# EAGLE design zeta2rework_lw (EAGLE 9.0.1)
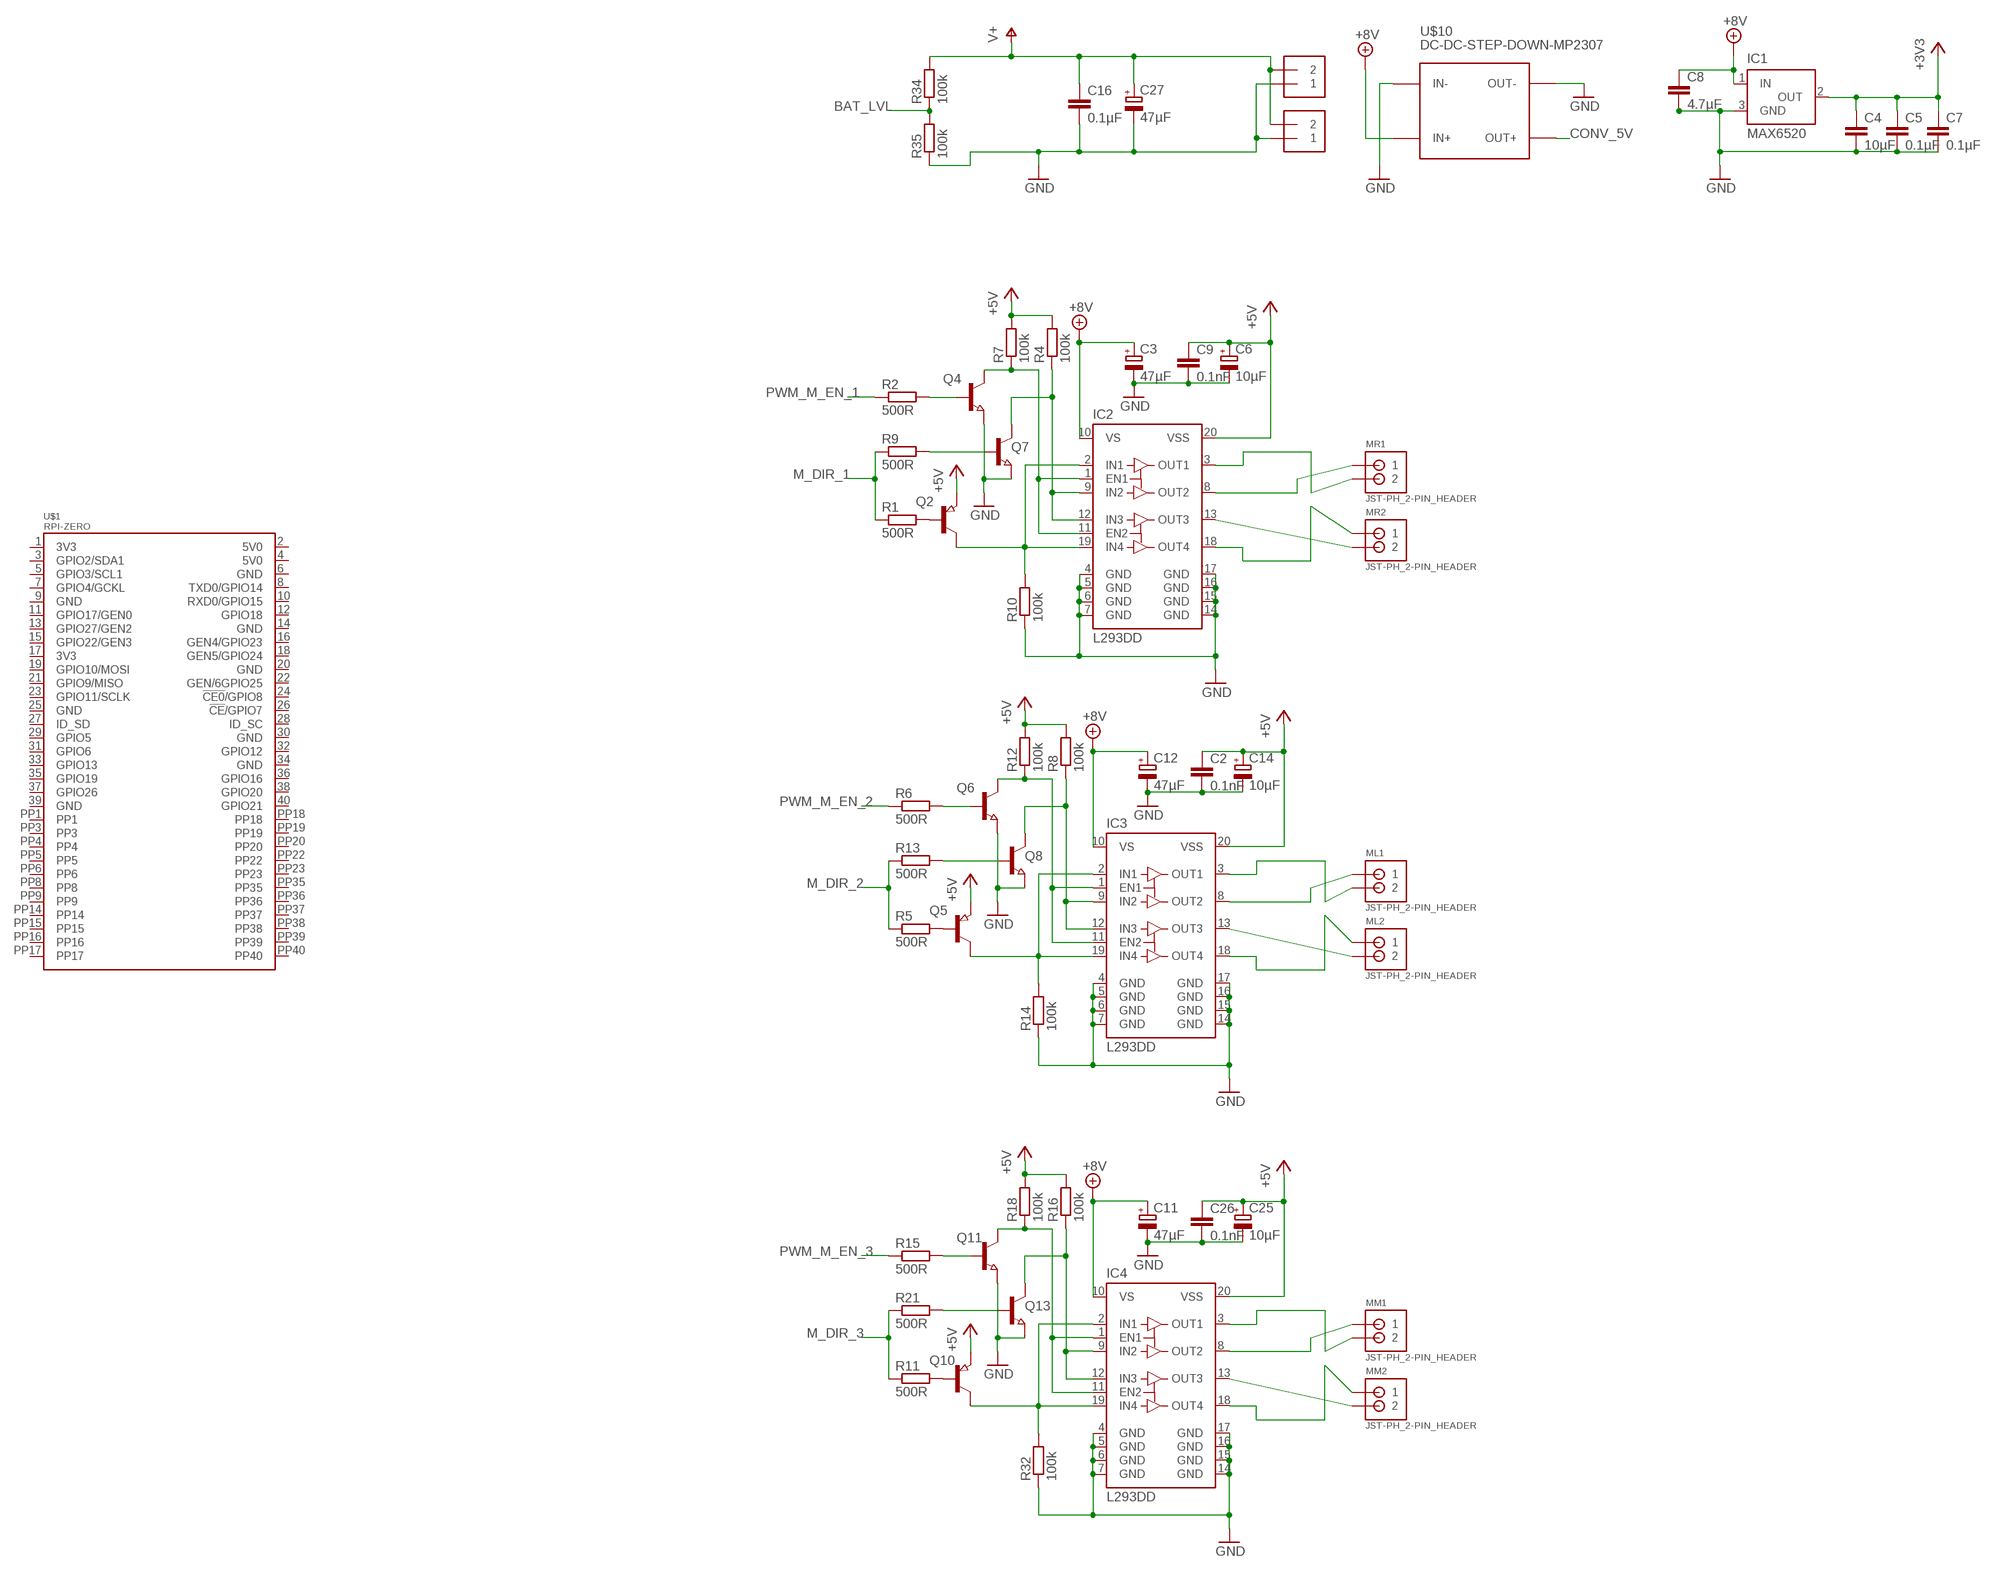
[diagram p0: schematic, sheet 1, part 1 of 2]
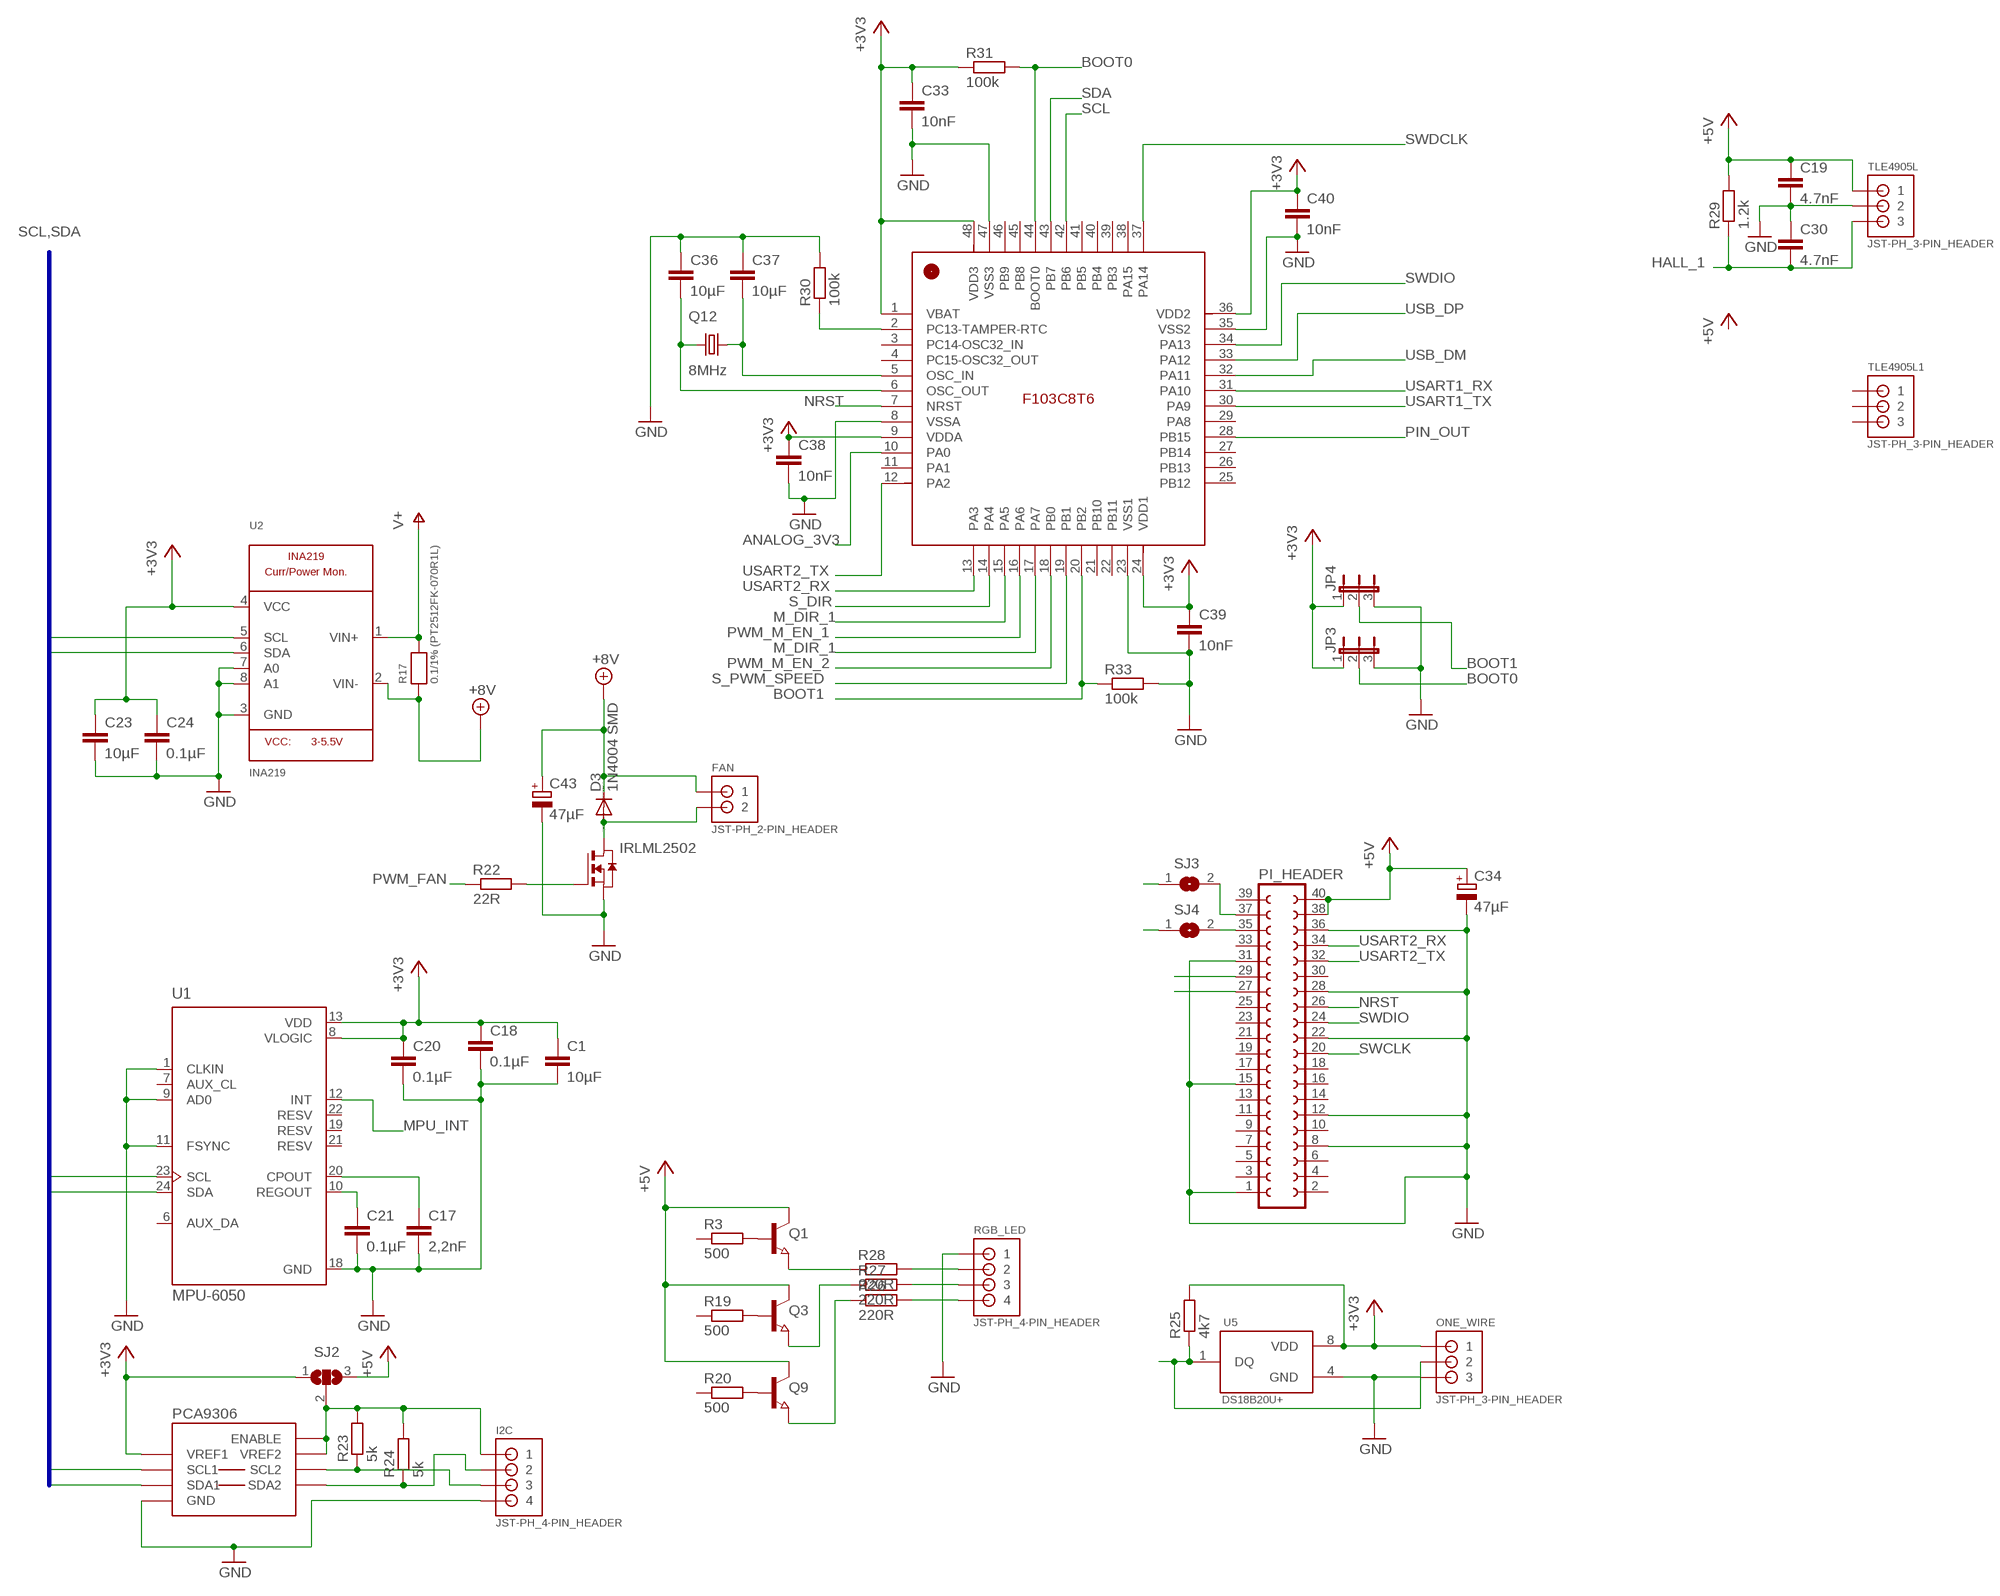
[diagram p1: schematic, sheet 1, part 2 of 2]

## Parts
C1  10µF  C-EUC1206  [C1206]
C2  0.1nF  C-EUC1206  [C1206]
C3  47µF  CPOL-EUUD-4X5,8  [UD-4X5,8_NICHICON]
C4  10µF  C-EUC1206  [C1206]
C5  0.1µF  C-EUC1206  [C1206]
C6  10µF  CPOL-EUUD-4X5,8  [UD-4X5,8_NICHICON]
C7  0.1µF  C-EUC1206  [C1206]
C8  4.7µF  C-EUC1206  [C1206]
C9  0.1nF  C-EUC1206  [C1206]
C11  47µF  CPOL-EUUD-4X5,8  [UD-4X5,8_NICHICON]
C12  47µF  CPOL-EUUD-4X5,8  [UD-4X5,8_NICHICON]
C14  10µF  CPOL-EUUD-4X5,8  [UD-4X5,8_NICHICON]
C16  0.1µF  C-EUC1206  [C1206]
C17  2,2nF  C-EUC1206  [C1206]
C18  0.1µF  C-EUC1206  [C1206]
C19  4.7nF  C-EUC1206  [C1206]
C20  0.1µF  C-EUC1206  [C1206]
C21  0.1µF  C-EUC1206  [C1206]
C23  10µF  C-EUC1206  [C1206]
C24  0.1µF  C-EUC1206  [C1206]
C25  10µF  CPOL-EUUD-4X5,8  [UD-4X5,8_NICHICON]
C26  0.1nF  C-EUC1206  [C1206]
C27  47µF  CPOL-EUUD-4X5,8  [UD-4X5,8_NICHICON]
C30  4.7nF  C-EUC1206  [C1206]
C33  10nF  C-EUC1206  [C1206]
C34  47µF  CPOL-EUUD-4X5,8  [UD-4X5,8_NICHICON]
C36  10µF  C-EUC1206  [C1206]
C37  10µF  C-EUC1206  [C1206]
C38  10nF  C-EUC1206  [C1206]
C39  10nF  C-EUC1206  [C1206]
C40  10nF  C-EUC1206  [C1206]
C43  47µF  CPOL-EUUD-4X5,8  [UD-4X5,8_NICHICON]
D3  1N4004 SMD  DIODE-MELF-MLL41  [MELF-MLL41]
FAN  JST-PH_2-PIN_HEADER  [JST_B2B-PH_HEADER]
I2C  JST-PH_4-PIN_HEADER  [JST_B4B-PH_HEADER]
IC1  MAX6520  [SOT23]
IC2  L293DD  [SO20]
IC3  L293DD  [SO20]
IC4  L293DD  [SO20]
IRLML2502  NMOSSOT23  [SOT-23]
JP3  JP2E  [JP2]
JP4  JP2E  [JP2]
ML1  JST-PH_2-PIN_HEADER  [JST_B2B-PH_HEADER]
ML2  JST-PH_2-PIN_HEADER  [JST_B2B-PH_HEADER]
MM1  JST-PH_2-PIN_HEADER  [JST_B2B-PH_HEADER]
MM2  JST-PH_2-PIN_HEADER  [JST_B2B-PH_HEADER]
MR1  JST-PH_2-PIN_HEADER  [JST_B2B-PH_HEADER]
MR2  JST-PH_2-PIN_HEADER  [JST_B2B-PH_HEADER]
ONE_WIRE  JST-PH_3-PIN_HEADER  [JST_B3B-PH_HEADER]
PCA9306  IC2_LEVEL_TRANSLATER  [SOIC-8]
PI_HEADER  FE20-2  [FE20-2]
Q1  NPN-TRANSISTOR_SOT23  [SOT23]
Q2  PNP-TRANSISTOR_SOT23  [SOT23]
Q3  NPN-TRANSISTOR_SOT23  [SOT23]
Q4  NPN-TRANSISTOR_SOT23  [SOT23]
Q5  PNP-TRANSISTOR_SOT23  [SOT23]
Q6  NPN-TRANSISTOR_SOT23  [SOT23]
Q7  NPN-TRANSISTOR_SOT23  [SOT23]
Q8  NPN-TRANSISTOR_SOT23  [SOT23]
Q9  NPN-TRANSISTOR_SOT23  [SOT23]
Q10  PNP-TRANSISTOR_SOT23  [SOT23]
Q11  NPN-TRANSISTOR_SOT23  [SOT23]
Q12  8MHz  KX-13  [7.0X5.0]
Q13  NPN-TRANSISTOR_SOT23  [SOT23]
R1  500R  R-EU_R0603  [R0603]
R2  500R  R-EU_R0603  [R0603]
R3  500  R-EU_R0603  [R0603]
R4  100k  R-EU_R0603  [R0603]
R5  500R  R-EU_R0603  [R0603]
R6  500R  R-EU_R0603  [R0603]
R7  100k  R-EU_R0603  [R0603]
R8  100k  R-EU_R0603  [R0603]
R9  500R  R-EU_R0603  [R0603]
R10  100k  R-EU_R0603  [R0603]
R11  500R  R-EU_R0603  [R0603]
R12  100k  R-EU_R0603  [R0603]
R13  500R  R-EU_R0603  [R0603]
R14  100k  R-EU_R0603  [R0603]
R15  500R  R-EU_R0603  [R0603]
R16  100k  R-EU_R0603  [R0603]
R17  0.1/1% (PT2512FK-070R1L)  RESISTOR2512  [2512]
R18  100k  R-EU_R0603  [R0603]
R19  500  R-EU_R0603  [R0603]
R20  500  R-EU_R0603  [R0603]
R21  500R  R-EU_R0603  [R0603]
R22  22R  R-EU_R0603  [R0603]
R23  5k  R-EU_R0603  [R0603]
R24  5k  R-EU_R0603  [R0603]
R25  4k7  R-EU_R0603  [R0603]
R26  220R  R-EU_R0603  [R0603]
R27  220R  R-EU_R0603  [R0603]
R28  220R  R-EU_R0603  [R0603]
R29  1.2k  R-EU_R0603  [R0603]
R30  100k  R-EU_R0603  [R0603]
R31  100k  R-EU_R0603  [R0603]
R32  100k  R-EU_R0603  [R0603]
R33  100k  R-EU_R0603  [R0603]
R34  100k  R-EU_R0603  [R0603]
R35  100k  R-EU_R0603  [R0603]
RGB_LED  JST-PH_4-PIN_HEADER  [JST_B4B-PH_HEADER]
SJ2  SJ2W  [SJ_2]
SJ3  SOLDERJUMPERREFLOW_NOPASTE  [SOLDERJUMPER_REFLOW_NOPASTE]
SJ4  SOLDERJUMPERREFLOW_NOPASTE  [SOLDERJUMPER_REFLOW_NOPASTE]
SUPPLY_IN  TERMBLOCK_1X2-3.5MM  [1X2-3.5MM]
SUPPLY_IN1  TERMBLOCK_1X2-3.5MM  [1X2-3.5MM]
TLE4905L  JST-PH_3-PIN_HEADER  [JST_B3B-PH_HEADER]
TLE4905L1  JST-PH_3-PIN_HEADER  [JST_B3B-PH_HEADER]
U1  MPU-6050  [QFN50P400X400X95-24N]
U2  INA219  [SOT23-8]
U5  DS18B20U+  [SOP65P490X95-8N]
U$1  RPI-ZERO  [RASP_PI_ZERO_BOARD_FULL]
U$4  STM32F103C8T6  [LQFP48_7X7MM_0.5MMPP]
U$10  DC-DC-STEP-DOWN-MP2307  [DC-DC-STEP-DOWN-MP2307]

## Nets
+3V3: C1.1 C4.1 C5.1 C7.1 C18.1 C20.1 C23.1 C24.1 C33.1 C38.1 C39.1 C40.1 IC1.2(OUT) JP3.1 JP4.1 ONE_WIRE.P1 PCA9306.1(VREF1) R25.2 R31.1 SJ2.1 U1.8(VLOGIC) U1.13(VDD) U2.4(VCC) U5.8(VDD) U$4.1(VBAT) U$4.9(VDDA) U$4.24(VDD1) U$4.36(VDD2) U$4.48(VDD3)
+5V: C2.1 C6.+ C9.1 C14.+ C19.1 C25.+ C26.1 C34.+ IC2.20(VSS) IC3.20(VSS) IC4.20(VSS) PI_HEADER.38 PI_HEADER.40 Q1.3(C) Q2.2(E) Q3.3(C) Q5.2(E) Q9.3(C) Q10.2(E) R4.2 R7.2 R8.2 R12.2 R16.2 R18.2 R29.2 SJ2.3 TLE4905L.P1
+8V: C3.+ C8.1 C11.+ C12.+ C43.+ D3.C FAN.P1 IC1.1(IN) IC2.10(VS) IC3.10(VS) IC4.10(VS) R17.1 U2.2(VIN-) U$10.IN+
ANALOG_3V3: U$4.10(PA0)
BAT_LVL: R34.1 R35.2
BOOT0: JP3.2 R31.2 U$4.44(BOOT0)
BOOT1: JP4.2 R33.1 U$4.20(PB2)
BOOT2: PI_HEADER.29
BOOT3: PI_HEADER.27
CONV_5V: U$10.OUT+
GND: C1.2 C2.2 C3.- C4.2 C5.2 C6.- C7.2 C8.2 C9.2 C11.- C12.- C14.- C16.2 C17.2 C18.2 C19.2 C20.2 C21.2 C23.2 C24.2 C25.- C26.2 C27.- C30.1 C33.2 C34.- C36.1 C37.1 C38.2 C39.2 C40.2 C43.- I2C.P4 IC1.3(GND) IC2.4(GND) IC2.5(GND) IC2.6(GND) IC2.7(GND) IC2.14(GND) IC2.15(GND) IC2.16(GND) IC2.17(GND) IC3.4(GND) IC3.5(GND) IC3.6(GND) IC3.7(GND) IC3.14(GND) IC3.15(GND) IC3.16(GND) IC3.17(GND) IC4.4(GND) IC4.5(GND) IC4.6(GND) IC4.7(GND) IC4.14(GND) IC4.15(GND) IC4.16(GND) IC4.17(GND) IRLML2502.2(S) JP3.3 JP4.3 ONE_WIRE.P3 PCA9306.4(GND) PI_HEADER.1 PI_HEADER.8 PI_HEADER.12 PI_HEADER.15 PI_HEADER.22 PI_HEADER.28 PI_HEADER.31 PI_HEADER.36 Q4.2(E) Q6.2(E) Q7.2(E) Q8.2(E) Q11.2(E) Q13.2(E) R10.1 R14.1 R30.2 R32.1 R33.2 R35.1 RGB_LED.P1 SUPPLY_IN1.1 SUPPLY_IN.1 TLE4905L.P2 U1.1(CLKIN) U1.9(AD0) U1.11(FSYNC) U1.18(GND) U2.3(GND) U2.7(A0) U2.8(A1) U5.4(GND) U$4.8(VSSA) U$4.23(VSS1) U$4.35(VSS2) U$4.47(VSS3) U$10.IN- U$10.OUT-
HALL_1: C30.2 R29.1 TLE4905L.P3
M_DIR_1: R1.1 R9.1 U$4.15(PA5) U$4.17(PA7)
M_DIR_2: R5.1 R13.1
M_DIR_3: R11.1 R21.1
MPU_INT: U1.12(INT)
N$1: IC2.9(IN2) IC2.12(IN3) Q7.3(C) R4.1
N$2: IC3.18(OUT4) ML2.P1
N$3: IC3.13(OUT3) ML2.P2
N$4: R26.2 RGB_LED.P4
N$5: IC2.2(IN1) IC2.19(IN4) Q2.3(C) R10.2
N$6: IC3.9(IN2) IC3.12(IN3) Q8.3(C) R8.1
N$7: IC3.2(IN1) IC3.19(IN4) Q5.3(C) R14.2
N$8: IC2.1(EN1) IC2.11(EN2) Q4.3(C) R7.1
N$9: IC3.1(EN1) IC3.11(EN2) Q6.3(C) R12.1
N$10: Q2.1(B) R1.2
N$11: Q4.1(B) R2.2
N$12: Q7.1(B) R9.2
N$13: Q5.1(B) R5.2
N$14: Q6.1(B) R6.2
N$15: Q8.1(B) R13.2
N$16: R27.2 RGB_LED.P3
N$17: IC2.8(OUT2) MR1.P1
N$18: IC2.3(OUT1) MR1.P2
N$19: R28.2 RGB_LED.P2
N$20: IC2.18(OUT4) MR2.P1
N$21: IC2.13(OUT3) MR2.P2
N$22: Q1.1(B) R3.2
N$23: Q3.1(B) R19.2
N$24: Q1.2(E) R28.1
N$25: IC3.8(OUT2) ML1.P1
N$26: IC3.3(OUT1) ML1.P2
N$27: IC4.9(IN2) IC4.12(IN3) Q13.3(C) R16.1
N$28: Q3.2(E) R27.1
N$29: Q9.2(E) R26.1
N$30: IC4.2(IN1) IC4.19(IN4) Q10.3(C) R32.2
N$31: IC4.1(EN1) IC4.11(EN2) Q11.3(C) R18.1
N$32: Q9.1(B) R20.2
N$33: Q10.1(B) R11.2
N$34: C17.1 U1.20(CPOUT)
N$35: Q11.1(B) R15.2
N$36: C21.1 U1.10(REGOUT)
N$37: IRLML2502.3(G) R22.2
N$41: I2C.P1 PCA9306.7(VREF2) PCA9306.8(ENABLE) R23.2 R24.2 SJ2.2
N$42: I2C.P3 PCA9306.6(SCL2) R23.1
N$43: I2C.P2 PCA9306.5(SDA2) R24.1
N$44: PI_HEADER.37 SJ3.2
N$45: PI_HEADER.35 SJ4.2
N$46: C36.2 Q12.1 U$4.6(OSC_OUT)
N$47: C37.2 Q12.3 U$4.5(OSC_IN)
N$48: Q13.1(B) R21.2
N$49: R30.1 U$4.2(PC13-TAMPER-RTC)
N$50: IC4.8(OUT2) MM1.P1
N$51: IC4.3(OUT1) MM1.P2
N$52: IC4.18(OUT4) MM2.P1
N$53: IC4.13(OUT3) MM2.P2
N$55: D3.A FAN.P2 IRLML2502.1(D)
NRST: PI_HEADER.26 U$4.7(NRST)
PIN_OUT: U$4.28(PB15)
PWM_FAN: R22.1
PWM_M_EN_1: R2.1 U$4.16(PA6)
PWM_M_EN_2: R6.1 U$4.18(PB0)
PWM_M_EN_3: R15.1
S_DIR: U$4.14(PA4)
S_PWM_SPEED: U$4.19(PB1)
SCL: U1.23(SCL) U2.5(SCL) U$4.42(PB6)
SCL2: PCA9306.2(SCL1)
SCL3: SJ4.1
SDA: U1.24(SDA) U2.6(SDA) U$4.43(PB7)
SDA2: PCA9306.3(SDA1)
SDA3: SJ3.1
SWCLK: PI_HEADER.20
SWDCLK: U$4.37(PA14)
SWDIO: PI_HEADER.24 U$4.34(PA13)
TEMPERATURE: ONE_WIRE.P2 R25.1 U5.1(DQ)
USART1_RX: U$4.31(PA10)
USART1_TX: U$4.30(PA9)
USART2_RX: PI_HEADER.34 U$4.13(PA3)
USART2_TX: PI_HEADER.32 U$4.12(PA2)
USB_DM: U$4.32(PA11)
USB_DP: U$4.33(PA12)
V+: C16.1 C27.+ R17.2 R34.2 SUPPLY_IN1.2 SUPPLY_IN.2 U2.1(VIN+)
Unconnected: PI_HEADER.2 PI_HEADER.3 PI_HEADER.4 PI_HEADER.5 PI_HEADER.6 PI_HEADER.7 PI_HEADER.9 PI_HEADER.10 PI_HEADER.11 PI_HEADER.13 PI_HEADER.14 PI_HEADER.16 PI_HEADER.17 PI_HEADER.18 PI_HEADER.19 PI_HEADER.21 PI_HEADER.23 PI_HEADER.25 PI_HEADER.30 PI_HEADER.33 PI_HEADER.39 R3.1 R19.1 R20.1 TLE4905L1.P1 TLE4905L1.P2 TLE4905L1.P3 U1.6(AUX_DA) U1.7(AUX_CL) U1.19(RESV) U1.21(RESV) U1.22(RESV) U$1.1(3V3) U$1.2(5V0) U$1.3(GPIO2/SDA1) U$1.4(5V0) U$1.5(GPIO3/SCL1) U$1.6(GND) U$1.7(GPIO4/GCKL) U$1.8(TXD0/GPIO14) U$1.9(GND) U$1.10(RXD0/GPIO15) U$1.11(GPIO17/GEN0) U$1.12(GPIO18) U$1.13(GPIO27/GEN2) U$1.14(GND) U$1.15(GPIO22/GEN3) U$1.16(GEN4/GPIO23) U$1.17(3V3) U$1.18(GEN5/GPIO24) U$1.19(GPIO10/MOSI) U$1.20(GND) U$1.21(GPIO9/MISO) U$1.22(GEN/6GPIO25) U$1.23(GPIO11/SCLK) U$1.24(!CE0!/GPIO8) U$1.25(GND) U$1.26(!CE!/GPIO7) U$1.27(ID_SD) U$1.28(ID_SC) U$1.29(GPIO5) U$1.30(GND) U$1.31(GPIO6) U$1.32(GPIO12) U$1.33(GPIO13) U$1.34(GND) U$1.35(GPIO19) U$1.36(GPIO16) U$1.37(GPIO26) U$1.38(GPIO20) U$1.39(GND) U$1.40(GPIO21) U$1.PP1 U$1.PP3 U$1.PP4 U$1.PP5 U$1.PP6 U$1.PP8 U$1.PP9 U$1.PP14 U$1.PP15 U$1.PP16 U$1.PP17 U$1.PP18 U$1.PP19 U$1.PP20 U$1.PP22 U$1.PP23 U$1.PP35 U$1.PP36 U$1.PP37 U$1.PP38 U$1.PP39 U$1.PP40 U$4.3(PC14-OSC32_IN) U$4.4(PC15-OSC32_OUT) U$4.11(PA1) U$4.21(PB10) U$4.22(PB11) U$4.25(PB12) U$4.26(PB13) U$4.27(PB14) U$4.29(PA8) U$4.38(PA15) U$4.39(PB3) U$4.40(PB4) U$4.41(PB5) U$4.45(PB8) U$4.46(PB9)

## Buses
SCL,SDA

## Library data of the parts
C1 C2 C4 C5 C7-C9 C16-C21 C23 C24 C26 C30 C33 C36-C40 = rcl:C-EU: CAPACITOR, European symbol; SPICEPREFIX: C
C3 C6 C11 C12 C14 C25 C27 C34 C43 = rcl:CPOL-EU: POLARIZED CAPACITOR, European symbol; SPICEPREFIX: C
D3 = diode:DIODE-: DIODE
FAN ML1 ML2 MM1 MM2 MR1 MR2 = srg:JST-PH_2-PIN_HEADER: 2-pin JST PH Shrouded Header, top entry P/N B2B-PH-K-S Mating connector PHR-2 Mating cable assembly: Sparkfun PRT-09914
I2C RGB_LED = srg:JST-PH_4-PIN_HEADER: 4-pin JST PH Shrouded Header, top entry P/N B4B-PH-K-S Mating connector PHR-4 Mating cable assembly: Sparkfun PRT-09916
IC1 = maxim:MAX6520: 1.2V Voltage Reference 50ppm/°C, SOT23, 3-Terminal Source: Data sheet; MF: MAXIM; MPN: MAX6520EUR-T; OC_FARNELL: unknown; OC_NEWARK: 02J4586
IC2-IC4 = st-microelectronics:L293DD: PUSH-PULL FOUR CHANNEL DRIVER WITH DIODES Source: http://www.st.com/stonline/books/pdf/docs/1330.pdf; OC_FARNELL: unknown
IRLML2502 = zetex:NMOSSOT23: MOS FET; OC_FARNELL: unknown; OC_NEWARK: unknown
JP3 JP4 = jumper:JP2E: JUMPER
ONE_WIRE TLE4905L TLE4905L1 = srg:JST-PH_3-PIN_HEADER: 3-pin JST PH Shrouded Header, top entry P/N B3B-PH-K-S Mating connector PHR-3
PCA9306 = srg:IC2_LEVEL_TRANSLATER: I2C Level Translator PCA9306 Data Sheet Sparkfun breakout board schematic
PI_HEADER = con-lsta:FE20-2: FEMALE HEADER; OC_FARNELL: unknown; OC_NEWARK: unknown
Q1 Q3 Q4 Q6-Q9 Q11 Q13 = semicon-smd-ipc:NPN-TRANSISTOR_: NPN TRANSISTOR
Q2 Q5 Q10 = semicon-smd-ipc:PNP-TRANSISTOR_: PNP TRANSISTOR
Q12 = crystal-geyer_V1_0:KX: Quartz Crystals (MHz) SMD: KX - Serie Model Size l/w/h [mm] Frequency Range Frequency Stability Temp. Range [°C] Load Capacitance AECQ 200 availabel Datasheet KX-4 KX-5 KX-6 KX-7 KX-9A KX-9B KX-12A KX-12B KX-13 KX-20 KX-K KX-KS 1.6/1.2/0.3 2.0/1.6/0.45 2.5/2.0/0.55 3.2/2.5/0.8 5.0/3.2/1.0 5.0/3.2/1.1 6.0/3.5/1.1 6.0/3.5/1.0 7.0/5.0 /1.3 11.6/5.5/1.6 12.3/4.5/4.2 12.3/4.5/3.2 24.0 ~ 80.0 MHz 16.0 ~ 80.0 MHz 12.0 ~ 80.0 MHz 8.0 ~ 60.0 MHz 7,68 ~ 300,0 MHz 8,0 ~ 50,0 MHz 8,0 ~ 150,0 MHz 8,0 ~ 50,0 MHz 6,0 ~ 160,0 MHz 3,579 ~ 25,0 MHz 3,579 ~ 70,0 MHz 3,579 ~ 70,0 MHz ±10 … ±50ppm ±10 … ±50ppm ±10 … ±50ppm ±10 … ±50ppm ±10 … ±50ppm ±10 … ±50ppm ±10 … ±50ppm ±10 … ±50ppm ±10 … ±50ppm ±50ppm ±10 … ±50ppm ±10 … ±50ppm (*) -40°C …+85°C (*) -40°C …+125°C (*) -40°C …+125°C (*) -40°C …+125°C (*) -40°C …+105°C (*) -40°C …+105°C (*) -40°C …+125°C (*) -40°C …+105°C (*) -40°C …+105°C (*) -40°C …+105°C (*) -40°C …+85°C (*) -40°C …+85°C 8, 8…16 8, 8…16 10, 8…16 12, 7…20 16, 10…20 16, 10…20 16, 10…20 16, 12…20 16, 12…20 16, 12…20 16, 12…30 16, 12…30 - yes yes yes - - - - - - - - KX-4.pdf KX-5.pdf KX-6.pdf KX-7.pdf KX-9A.pdf KX-9B.pdf KX-12A.pdf KX-12B.pdf KX-13.pdf KX-20.pdf KX-K.pdf KX-KS.pdf Details see: http://www.geyer-electronic.de/Frequenz-Produkte.9.0.html Created 2016-06-07, Hans Locher 2016 (C) Geyer Quartz Technology KX4,KX5,KX6,KX7,KX9A,KX9B,KX12A,KX12B,KX13,KX20,KXK,KXKS;1612;2016;2520;3225;5032;6035;7050;11655;12345;1,6x1,2;2,0x1,6;2,5x2,0;3,2x2,5;5,0x3,2;6,0x3,5;7,0x5,0;11,6x5,5;12,3x4,5;12,3x4,5;1.6x1.2;2.0x1.6;2.5x2.0;3.2x2.5;5.0x3.2;6.0x3.5;7.0x5.0;11.6x5.5;12.3x4.5;12.3x4.5;
R1-R16 R18-R35 = rcl:R-EU_: RESISTOR, European symbol; SPICEPREFIX: R
R17 = microbuilder:RESISTOR: Resistors 0402 - 0402 Surface Mount Package 22 Ohm 1% 1/16W [Digikey: 311-22.0LRTR-ND] 33 Ohm 5% 1/16W 1.0K 5% 1/16W 1.5K 5% 1/16W 2.0K 1% 1/16W 10.0K 1% 1/16W [Digikey: 311-10.0KLRTR-ND] 10.0K 5% 1/16W [Digikey: RMCF0402JT10K0TR-ND] 12.1K 1% 1/16W [Digikey: 311-22.0LRTR-ND] 100.0K 5% 1/16W 0603 - 0603 Surface Mount Package 0 Ohm 1/10 Watt 1% Resistor 15 Ohm 1/10 Watt 1% Resistor 33 Ohm 1/10 Watt 1% Resistor 49.9 Ohm 1/10 Watt 1% Resistor 100 Ohm 1/10 Watt 1% Resistor 150 Ohm 1/10 Watt 1% Resistor 240 Ohm 1/10 Watt 1% Resistor 390 Ohm 1/10 Watt 1% Resistor 560 Ohm 1/10 Watt 1% Resistor 680 Ohm 1/10 Watt 1% Resistor 750 Ohm 1/10 Watt 1% Resistor 1.0K Ohm 1/10 Watt 1% Resistor 1.5K Ohm 1/10 Watt 1% Resistor 2.0K Ohm 1/10 Watt 1% Resistor 2.2K Ohm 1/10 Watt 1% Resistor 3.3K Ohm 1/10 Watt 1% Resistor 4.7K Ohm 1/10 Watt 1% Resistor 10.0K Ohm 1/10 Watt 1% Resistor 12.0K Ohm 1/10 Watt 1% Resistor 12.1K Ohm 1/10 Watt 1% Resistor 20.0K Ohm 1/10 Watt 1% Resistor 33.0K Ohm 1/10 Watt 1% Resistor 100.0K Ohm 1/10 Watt 1% Resistor 0805 - 0805 Surface Mount Package 0 Ohm 1/8 Watt 1% Resistor 33 Ohm 1/8 Watt 1% Resistor 100 Ohm 1/8 Watt 1% Resistor 150 Ohm 1/8 Watt 1% Resistor 200 Ohm 1/8 Watt 1% Resistor 240 Ohm 1/8 Watt 1% Resistor 330 Ohm 1/8 Watt 1% Resistor 390 Ohm 1/8 Watt 1% Resistor 470 Ohm 1/8 Watt 1% Resistor 1.0K Ohm 1/8 Watt 1% Resistor 1.5K Ohm 1/8 Watt 1% Resistor 2.0K Ohm 1/8 Watt 1% Resistor 4.7K Ohm 1/8 Watt 1% Resistor 5.1K Ohm 1/8 Watt 1% Resistor 5.6K Ohm 1/8 Watt 1% Resistor 10.0K Ohm 1/8 Watt 1% Resistor 22.0K Ohm 1/8 Watt 1% Resistor 33.0K Ohm 1/8 Watt 1% Resistor 100K Ohm 1/8 Watt 1% Resistor 1206 - 1206 Surface Mount Package 2012 - 2010 Surface Mount Package 0.11 Ohm 1/2 Watt 1% Resistor - Digikey: RHM.11UCT-ND
SJ2 = jumper:SJ2W: SMD solder JUMPER
SJ3 SJ4 = microbuilder:SOLDERJUMPER: SMD Solder JUMPER Solder the two pads together to create a connection, or remove the solder to break it. REFLOW - Use this footprint for solder paste and reflow ovens. WAVE - Use this footprint for hand-soldering (larger pads). CLOSED - Has a trace between the two pads to ensure it is closed by default. The trace needs to be cut to disable the jumper, and can be closed again by creating a solder bridge between the two pads.
SUPPLY_IN SUPPLY_IN1 = microbuilder:TERMBLOCK_1X2: 3.5mm Terminal block http://www.ladyada.net/library/pcb/eaglelibrary.html
U1 = MPU-6050:MPU-6050: MPU-6050 Six-Axis (Gyro + Accelerometer) MEMS MotionTracking™ Devices; AVAILABILITY: Good; DESCRIPTION: 3-axis gyroscope, 3-axis accelerometer in a 4x4x0.9 housing; MF: TDK; MP: MPU-6050; PACKAGE: QFN-24 InvenSense; PRICE: 5.12 USD
U2 = INA219:INA219: INA219 - I2C Current/Power Monitor Voltage Range: 0-26V Accuracy: 0.5% Temperature: -40°C - 125°C; AVAILABILITY: Unavailable; DESCRIPTION: the ina219 is a high-side current shunt and power monitor with an i2c interface. the ina219 monitors both shunt drop ...; MF: Texas Instruments; MP: INA219; PACKAGE: None; PRICE: None
U5 = DS18B20U_:DS18B20U+: Board Mount Temperature Sensors Prgmble Resolution 1-Wire Parasite Pwr; AVAILABILITY: Unavailable; DESCRIPTION: Date Code: 1043+; RoHS Compliant: Yes;; MF: Maxim; MP: DS18B20U+; PACKAGE: TSSOP-8 Chip Coolers; PRICE: None
U$1 = rpi-zero:RPI-ZERO
U$4 = STM32F103C8T6:STM32F103C8T6; AVAILABILITY: Good; DESCRIPTION: Mainstream Performance line, ARM Cortex-M3 MCU with 64 Kbytes Flash, 72 MHz CPU, motor control, USB and CAN; MF: STMicroelectronics; MP: STM32F103C8T6; PACKAGE: LQFP-48 STMicroelectronics; PRICE: 3.83 USD
U$10 = diy-modules:DC-DC-STEP-DOWN-MP2307: DC/DC Step-Down Regulator based on MP2307DN chip MP2307 datasheet available here: https://cdn-shop.adafruit.com/datasheets/MP2307_r1.9.pdf Click here to find device on ebay.com

## Board
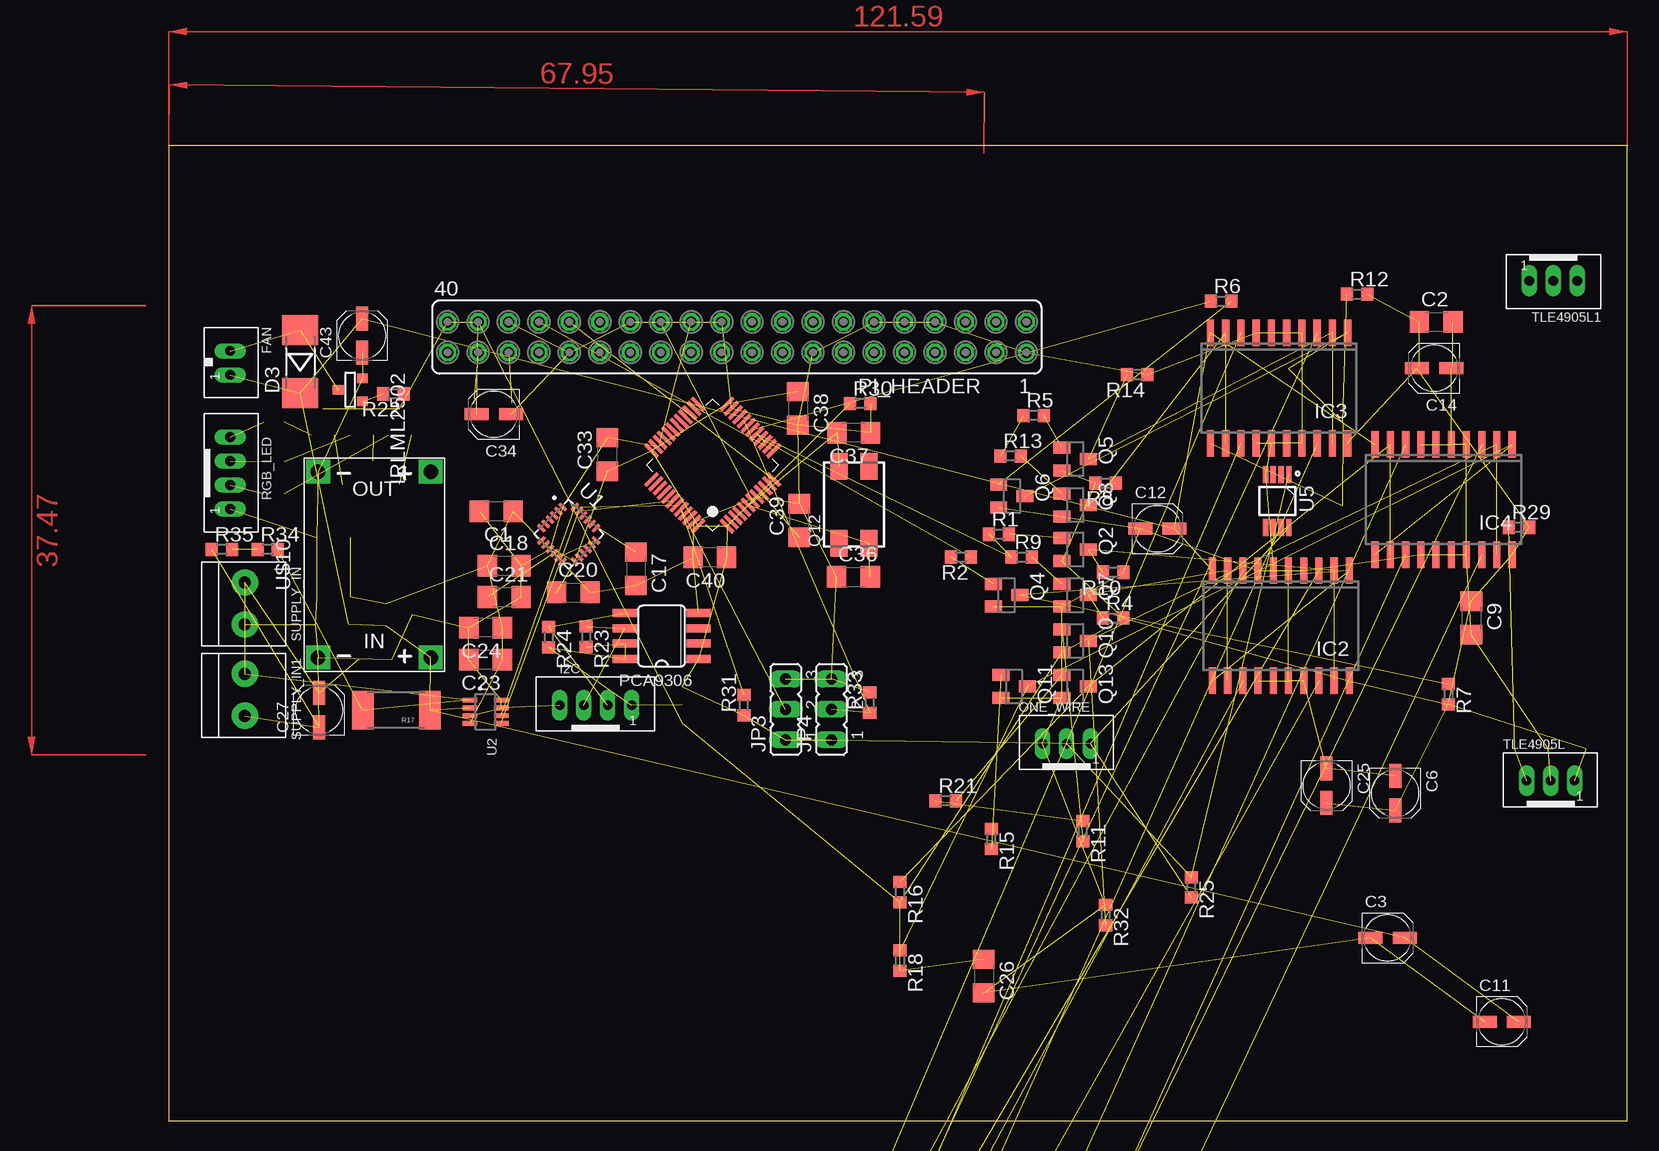
[diagram p2: board, top side]
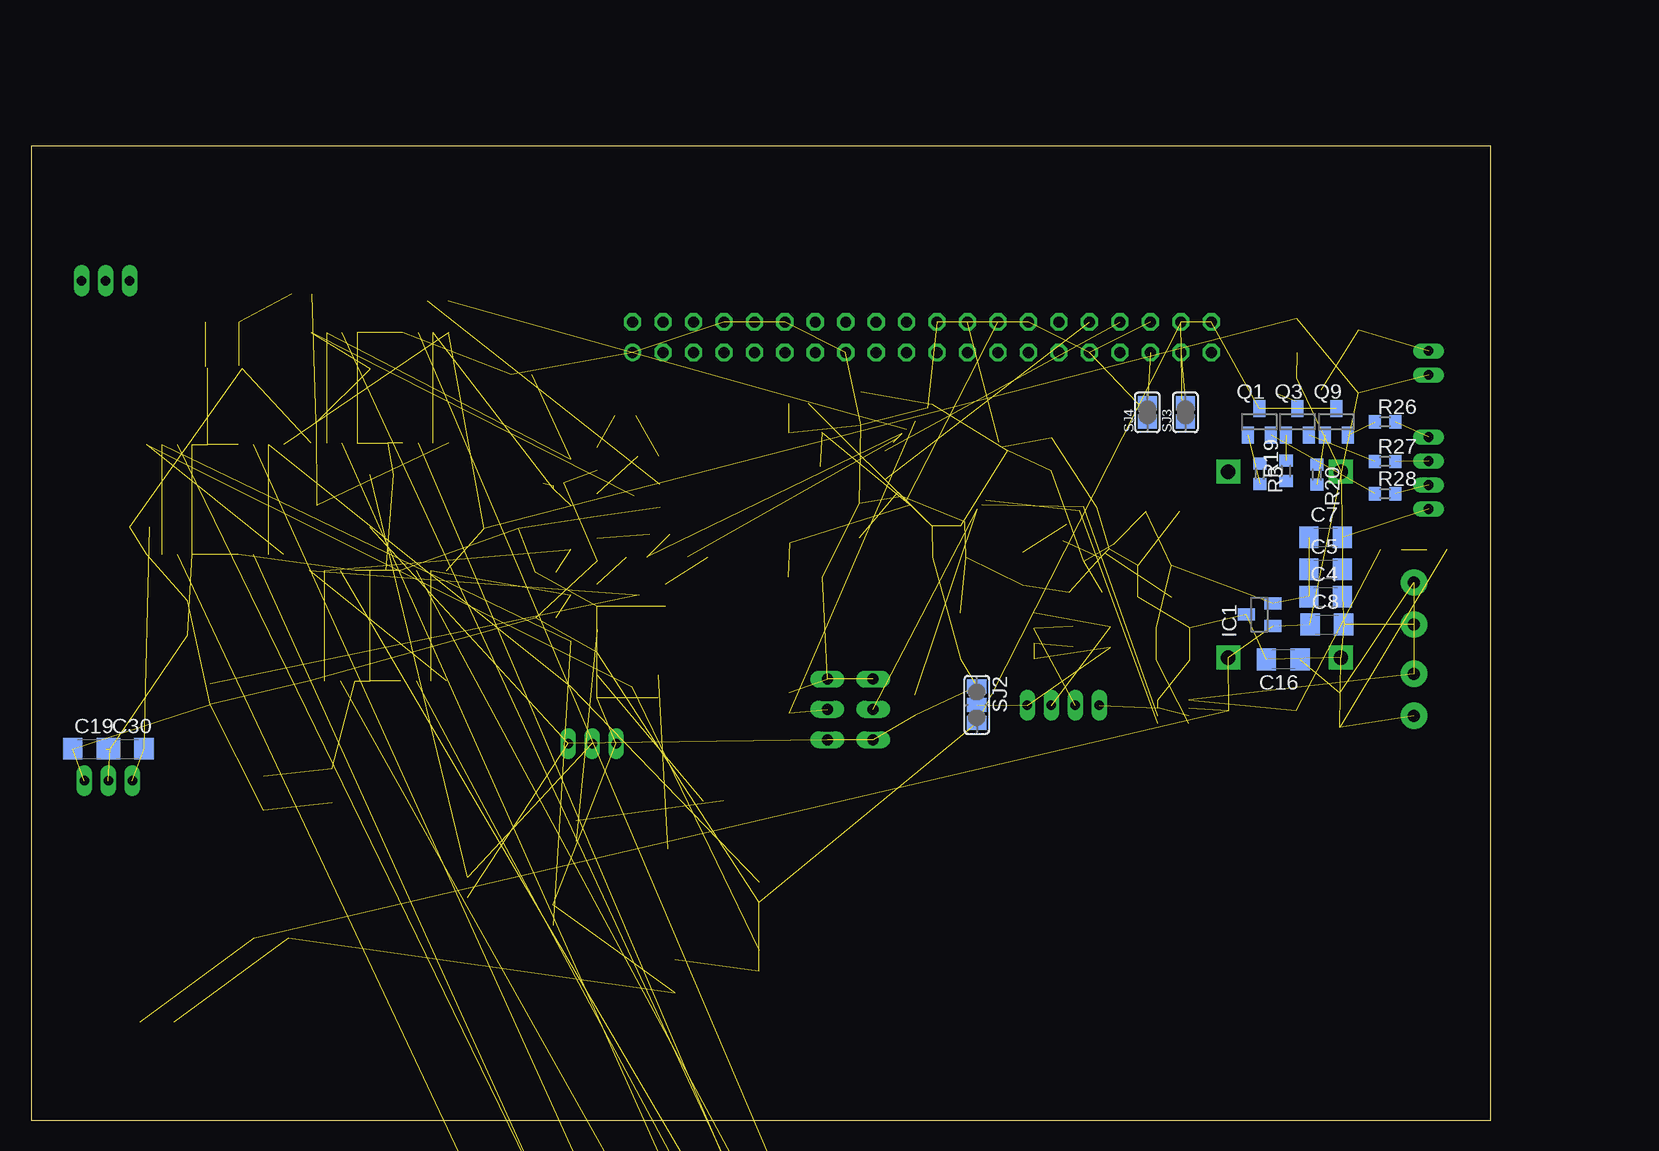
[diagram p3: board, bottom side, seen from below]

Size 121.59 x 81.27 mm. Coordinates in mm from the lower left corner, seen from the top.
Outline: 0,0 121.59,0 121.59,81.27 0,81.27 0,0
Copper layers (1*16): Top 0.035mm / dielectric 1.5mm / Bottom 0.035mm
Design rules "default": minimum track width 6mil, minimum drill 0.35mm, track to track 6mil, track to pad 6mil, pad to pad 6mil, via to via 6mil, smd to smd 6mil, copper to edge 40mil, drill to drill 6mil, minimum pad ring 10mil, minimum via ring 8mil, stop-mask expansion 4mil, vias tented up to drill 0mil, thermal gap 10mil

### Footprints (pad centres in the part's own frame; a part is rotated, then mirrored left to right if it is on the bottom)
C1206 = smd 1.6 x 1.8: 1 -1.4,0; 2 1.4,0
UD-4X5,8_NICHICON = smd 2 x 1: + 1.425,0; - -1.425,0
MELF-MLL41 = smd 2.5 x 3: A 2.625,0; C -2.625,0
JST_B2B-PH_HEADER = drill 0.8 long: P1 1.075,0.048; P2 -0.925,0.048
JST_B4B-PH_HEADER = drill 0.8 long: P1 2.98,0.048; P2 0.98,0.048; P3 -1.02,0.048; P4 -3.02,0.048
SOT23 = smd 1 x 1.4: 1 -0.95,-1.1; 2 0.95,-1.1; 3 0,1.1
SO20 = smd 0.6 x 2.2: 1 -5.715,-4.6; 2 -4.445,-4.6; 3 -3.175,-4.6; 4 -1.905,-4.6; 5 -0.635,-4.6; 6 0.635,-4.6; 7 1.905,-4.6; 8 3.175,-4.6; 9 4.445,-4.6; 10 5.715,-4.6; 11 5.715,4.6; 12 4.445,4.6; 13 3.175,4.6; 14 1.905,4.6; 15 0.635,4.6; 16 -0.635,4.6; 17 -1.905,4.6; 18 -3.175,4.6; 19 -4.445,4.6; 20 -5.715,4.6
SOT-23 = smd 0.787 x 0.889: 1 0.025,-1.016; 2 -0.94,1.016; 3 0.991,1.016
JP2 = drill 0.914 long: 1 -2.54,0; 2 0,0; 3 2.54,0
JST_B3B-PH_HEADER = drill 0.8 long: P1 2.027,0.048; P2 0.028,0.048; P3 -1.972,0.048
SOIC-8 = smd 0.66 x 2.032: 1 -1.905,-3.073; 2 -0.635,-3.073; 3 0.635,-3.073; 4 1.905,-3.073; 5 1.905,3.073; 6 0.635,3.073; 7 -0.635,3.073; 8 -1.905,3.073
FE20-2 = drill 0.914: 1 -24.13,1.27 | drill 0.914 octagon: 2 -24.13,-1.27; 3 -21.59,1.27; 4 -21.59,-1.27; 5 -19.05,1.27; 6 -19.05,-1.27; 7 -16.51,1.27; 8 -16.51,-1.27; 9 -13.97,1.27; 10 -13.97,-1.27; 11 -11.43,1.27; 12 -11.43,-1.27; 13 -8.89,1.27; 14 -8.89,-1.27; 15 -6.35,1.27; 16 -6.35,-1.27; 17 -3.81,1.27; 18 -3.81,-1.27; 19 -1.27,1.27; 20 -1.27,-1.27; 21 1.27,1.27; 22 1.27,-1.27; 23 3.81,1.27; 24 3.81,-1.27; 25 6.35,1.27; 26 6.35,-1.27; 27 8.89,1.27; 28 8.89,-1.27; 29 11.43,1.27; 30 11.43,-1.27; 31 13.97,1.27; 32 13.97,-1.27; 33 16.51,1.27; 34 16.51,-1.27; 35 19.05,1.27; 36 19.05,-1.27; 37 21.59,1.27; 38 21.59,-1.27; 39 24.13,1.27; 40 24.13,-1.27
7.0X5.0 = smd 2.2 x 1.4: 1 -3.2,-1.25; 2 3.2,-1.25; 3 3.2,1.25; 4 -3.2,1.25
R0603 = smd 1 x 1.1: 1 -0.85,0; 2 0.85,0
2512 = smd 1.8 x 3.2: 1 -2.8,0; 2 2.8,0
SJ_2 = smd 1.168 x 1.6: 1 -1.524,0; 2 0,0; 3 1.524,0
SOLDERJUMPER_REFLOW_NOPASTE = smd 1.168 x 1.6: 1 -0.762,0; 2 0.762,0
1X2-3.5MM = drill 1 pad 2.184: 1 1.8,0; 2 -1.7,0
QFN50P400X400X95-24N = smd 0.79 x 0.26: 1 -1.97,1.25; 2 -1.97,0.75; 3 -1.97,0.25; 4 -1.97,-0.25; 5 -1.97,-0.75; 6 -1.97,-1.25; 13 1.97,-1.25; 14 1.97,-0.75; 15 1.97,-0.25; 16 1.97,0.25; 17 1.97,0.75; 18 1.97,1.25 | smd 0.26 x 0.79: 7 -1.25,-1.97; 8 -0.75,-1.97; 9 -0.25,-1.97; 10 0.25,-1.97; 11 0.75,-1.97; 12 1.25,-1.97; 19 1.25,1.97; 20 0.75,1.97; 21 0.25,1.97; 22 -0.25,1.97; 23 -0.75,1.97; 24 -1.25,1.97
SOT23-8 = smd 0.4 x 1.2: 1 -0.975,-1.3; 2 -0.325,-1.3; 3 0.325,-1.3; 4 0.975,-1.3; 5 0.975,1.3; 6 0.325,1.3; 7 -0.325,1.3; 8 -0.975,1.3
SOP65P490X95-8N = smd 1.4 x 0.45: 1 -2.2,0.975; 2 -2.2,0.325; 3 -2.2,-0.325; 4 -2.2,-0.975; 5 2.2,-0.975; 6 2.2,-0.325; 7 2.2,0.325; 8 2.2,0.975
RASP_PI_ZERO_BOARD_FULL = drill 1 pad 1.778 square: 1 8.37,25.23 | drill 1 pad 1.778: 2 8.37,27.77; 3 10.91,25.23; 4 10.91,27.77; 5 13.45,25.23; 6 13.45,27.77; 7 15.99,25.23; 8 15.99,27.77; 9 18.53,25.23; 10 18.53,27.77; 11 21.07,25.23; 12 21.07,27.77; 13 23.61,25.23; 14 23.61,27.77; 15 26.15,25.23; 16 26.15,27.77; 17 28.69,25.23; 18 28.69,27.77; 19 31.23,25.23; 20 31.23,27.77; 21 33.77,25.23; 22 33.77,27.77; 23 36.31,25.23; 24 36.31,27.77; 25 38.85,25.23; 26 38.85,27.77; 27 41.39,25.23; 28 41.39,27.77; 29 43.93,25.23; 30 43.93,27.77; 31 46.47,25.23; 32 46.47,27.77; 33 49.01,25.23; 34 49.01,27.77; 35 51.55,25.23; 36 51.55,27.77; 37 54.09,25.23; 38 54.09,27.77; 39 56.63,25.23; 40 56.63,27.77 | drill 0.8 pad 1.778: PP1 10.699,4.832; PP3 7.593,8.858; PP4 7.133,14.38; PP5 55.796,23.124; PP6 10.699,2.301; PP8 5.177,8.858; PP9 9.549,14.38; PP14 58.327,18.407; PP15 55.796,14.265; PP16 55.796,20.363; PP17 58.212,21.743; PP18 55.796,17.027; PP19 58.327,15.186; PP20 56.832,9.434; PP35 17.257,2.416; PP36 60.628,12.425; PP37 56.026,2.071; PP38 53.726,2.416; PP39 58.097,12.54; PP40 18.867,6.212 | drill 0.8 pad 1.422: PP22 23.009,2.071; PP23 24.734,2.071 | hole 2.75: 3.5,3.5; 3.5,26.5; 61.5,3.5; 61.5,26.5
LQFP48_7X7MM_0.5MMPP = smd 1.5 x 0.3: 1 -4.45,2.75; 2 -4.45,2.25; 3 -4.45,1.75; 4 -4.45,1.25; 5 -4.45,0.75; 6 -4.45,0.25; 7 -4.45,-0.25; 8 -4.45,-0.75; 9 -4.45,-1.25; 10 -4.45,-1.75; 11 -4.45,-2.25; 12 -4.45,-2.75; 25 4.45,-2.75; 26 4.45,-2.25; 27 4.45,-1.75; 28 4.45,-1.25; 29 4.45,-0.75; 30 4.45,-0.25; 31 4.45,0.25; 32 4.45,0.75; 33 4.45,1.25; 34 4.45,1.75; 35 4.45,2.25; 36 4.45,2.75 | smd 0.3 x 1.5: 13 -2.75,-4.45; 14 -2.25,-4.45; 15 -1.75,-4.45; 16 -1.25,-4.45; 17 -0.75,-4.45; 18 -0.25,-4.45; 19 0.25,-4.45; 20 0.75,-4.45; 21 1.25,-4.45; 22 1.75,-4.45; 23 2.25,-4.45; 24 2.75,-4.45; 37 2.75,4.45; 38 2.25,4.45; 39 1.75,4.45; 40 1.25,4.45; 41 0.75,4.45; 42 0.25,4.45; 43 -0.25,4.45; 44 -0.75,4.45; 45 -1.25,4.45; 46 -1.75,4.45; 47 -2.25,4.45; 48 -2.75,4.45
DC-DC-STEP-DOWN-MP2307 = drill 1.2 pad 2 square: IN+ -7.747,-4.699; IN- -7.747,4.699; OUT+ 7.747,-4.699; OUT- 7.747,4.699

### Placement (x,y rotation side)
C1  27.3,50.8 180 top
C2  105.66,66.6 0 top
C3  101.6,15.24 0 top
C4  13.72,43.69 0 bottom
C5  13.72,45.97 0 bottom
C6  102.23,27.3 270 top
C7  13.72,48.64 0 bottom
C8  13.61,41.38 0 bottom
C9  108.58,41.91 270 top
C11  111.12,8.25 0 top
C12  82.42,49.35 0 top
C14  105.49,62.74 180 top
C16  17.25,38.46 180 bottom
C17  38.94,46.02 270 top
C18  27.97,46.28 0 top
C19  116.76,31.01 0 bottom
C20  33.73,44.04 0 top
C21  27.97,43.66 0 top
C23  26.42,38.43 180 top
C24  26.42,41.1 180 top
C25  96.52,27.94 270 top
C26  67.94,12.07 270 top
C27  12.53,34.23 90 top
C30  113.61,31.01 0 bottom
C33  36.58,55.55 90 top
C34  27.1,58.9 180 top
C36  57.07,45.34 0 top
C37  57.1,57.35 180 top
C38  52.45,59.39 270 top
C39  52.58,50.04 90 top
C40  45.11,46.96 179.8 top
C43  16.13,65.46 90 top
D3  10.97,63.27 90 top
FAN  5.08,63.25 270 top
I2C  35.61,34.59 0 top
IC1  19.23,42.19 90 bottom
IC2  92.71,41.27 180 top
IC3  92.56,61.09 180 top
IC4  106.27,51.79 180 top
IRLML2502  15.14,60.96 270 top
JP3  51.44,34.29 90 top
JP4  55.25,34.29 90 top
ML1  -6.99,-158.11 0 top  (outside the outline)
ML2  -6.99,-171.45 0 top  (outside the outline)
MM1  -6.99,-184.78 0 top  (outside the outline)
MM2  -6.99,-198.12 0 top  (outside the outline)
MR1  -6.99,-131.44 0 top  (outside the outline)
MR2  -6.99,-144.78 0 top  (outside the outline)
ONE_WIRE  74.83,31.39 0 top
PCA9306  41.1,40.41 90 top
PI_HEADER  47.37,65.33 180 top
Q1  19.25,58.27 0 bottom
Q2  75.56,47.62 270 top
Q3  16.08,58.27 0 bottom
Q4  69.85,43.81 270 top
Q5  75.56,55.17 270 top
Q6  70.28,52.07 270 top
Q7  75.56,43.81 270 top
Q8  75.56,51.33 270 top
Q9  12.83,58.27 0 bottom
Q10  75.56,40 270 top
Q11  70.48,36.2 270 top
Q12  57.12,51.36 90 top
Q13  75.56,36.2 270 top
R1  69.21,48.89 0 top
R2  66.04,46.99 180 top
R3  19.2,53.95 270 bottom
R4  78.74,41.91 0 top
R5  72.11,58.8 0 top
R6  87.73,68.33 0 top
R7  106.68,35.56 270 top
R8  78.1,53.16 180 top
R9  71.12,46.99 0 top
R10  78.74,45.72 180 top
R11  76.2,24.13 270 top
R12  99.06,68.91 0 top
R13  70.18,55.42 0 top
R14  80.75,62.2 180 top
R15  68.58,23.49 270 top
R16  60.96,19.05 270 top
R17  18.97,34.21 180 top
R18  60.96,13.34 270 top
R19  17.02,54.18 90 bottom
R20  14.45,53.87 270 bottom
R21  64.77,26.67 0 top
R22  18.72,60.6 180 top
R23  34.8,40.34 270 top
R24  31.67,40.31 270 top
R25  85.24,19.46 270 top
R26  8.76,58.27 0 bottom
R27  8.76,54.97 0 bottom
R28  8.76,52.27 0 bottom
R29  112.57,49.48 0 top
R30  57.66,59.79 0 top
R31  47.96,34.65 90 top
R32  78.1,17.14 270 top
R33  58.45,34.85 90 top
R34  8.26,47.62 0 top
R35  4.45,47.62 0 top
RGB_LED  5.08,53.98 270 top
SJ2  42.8,34.67 270 bottom
SJ3  25.4,59.05 90 bottom
SJ4  28.57,59.05 90 bottom
SUPPLY_IN  6.35,43.18 270 top
SUPPLY_IN1  6.35,35.56 270 top
TLE4905L  115.16,28.3 0 top
TLE4905L1  115.44,70.08 180 top
U1  33.35,48.89 315 top
U2  26.42,34.09 270 top
U5  92.41,51.66 270 top
U$1  -1.27,-35.56 0 top  (outside the outline)
U$4  45.34,54.66 135 top
U$10  17.14,46.35 90 top

### Tracks (layer width: path | path; a pad name or v marks a point on that pad's centre or on a via)
+3V3  (28 unrouted)
+5V  (27 unrouted)
  Top 0.61: 104.04,62.71 C14.+ 104.26,62.94
+8V  (13 unrouted)
BAT_LVL  (1 unrouted)
BOOT0  (2 unrouted)
BOOT1  (2 unrouted)
GND  (100 unrouted)
  Top 0.61: 107.06,62.89 C14.-
HALL_1  (2 unrouted)
M_DIR_1  (3 unrouted)
M_DIR_2  (1 unrouted)
M_DIR_3  (1 unrouted)
N$1  (3 unrouted)
N$2  (1 unrouted)
N$3  (1 unrouted)
N$4  (1 unrouted)
N$5  (3 unrouted)
N$6  (6 unrouted)
N$7  (3 unrouted)
N$8  (3 unrouted)
N$9  (7 unrouted)
N$10  (1 unrouted)
N$11  (1 unrouted)
N$12  (1 unrouted)
N$13  (1 unrouted)
N$14  (1 unrouted)
N$15  (1 unrouted)
N$16  (1 unrouted)
N$17  (1 unrouted)
N$18  (1 unrouted)
N$19  (1 unrouted)
N$20  (1 unrouted)
N$21  (1 unrouted)
N$22  (1 unrouted)
N$23  (1 unrouted)
N$24  (1 unrouted)
N$25  (1 unrouted)
N$26  (1 unrouted)
N$27  (3 unrouted)
N$28  (1 unrouted)
N$29  (1 unrouted)
N$30  (3 unrouted)
N$31  (3 unrouted)
N$32  (1 unrouted)
N$33  (1 unrouted)
N$34  (1 unrouted)
N$35  (1 unrouted)
N$36  (1 unrouted)
N$37  (1 unrouted)
N$41  (5 unrouted)
N$42  (2 unrouted)
N$43  (2 unrouted)
N$44  (1 unrouted)
N$45  (1 unrouted)
N$46  (2 unrouted)
N$47  (2 unrouted)
N$48  (1 unrouted)
N$49  (1 unrouted)
N$50  (1 unrouted)
N$51  (1 unrouted)
N$52  (1 unrouted)
N$53  (1 unrouted)
N$55  (2 unrouted)
NRST  (1 unrouted)
PWM_M_EN_1  (1 unrouted)
PWM_M_EN_2  (1 unrouted)
SCL  (2 unrouted)
SDA  (2 unrouted)
SWDIO  (1 unrouted)
TEMPERATURE  (2 unrouted)
USART2_RX  (1 unrouted)
USART2_TX  (1 unrouted)
V+  (6 unrouted)
(copper drawn outside any net)
  shapes: Top area x3